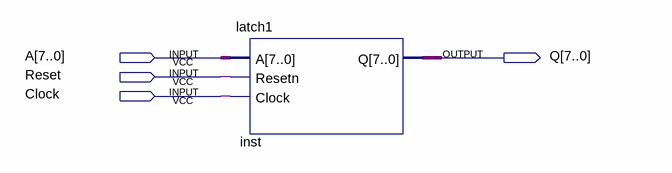
[diagram p0: schematic sheet]
// Quartus schematic latch1_bdf.bdf as structural Verilog: 1 symbols, 4 pins
module latch1_bdf (
  input  [7:0] A,
  input  Reset,
  input  Clock,
  output [7:0] Q
);

  latch1 inst (.A(A), .Resetn(Reset), .Clock(Clock), .Q(Q));
endmodule
